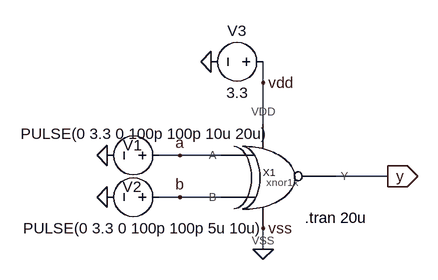
[diagram p0: schematic xnor1x_tb_tran.asc]
xnor1x_tb_tran.asc, the LTspice schematic file:
Version 4.1
SHEET 1 880 680
WIRE 160 16 160 -16
WIRE 160 80 160 16
WIRE 32 128 0 128
WIRE 96 128 32 128
WIRE 352 160 272 160
WIRE 32 192 0 192
WIRE 96 192 32 192
WIRE 160 272 160 240
FLAG 160 272 0
FLAG 352 160 y
IOPIN 352 160 Out
FLAG -80 128 0
FLAG -80 192 0
FLAG 80 -16 0
FLAG 32 128 a
FLAG 32 192 b
FLAG 160 16 vdd
FLAG 160 240 vss
SYMBOL voltage 16 128 R90
WINDOW 0 0 57 VBottom 2
WINDOW 3 -49 37 VTop 2
WINDOW 123 0 0 Left 0
WINDOW 39 0 0 Left 0
SYMATTR InstName V1
SYMATTR Value PULSE(0 3.3 0 100p 100p 10u 20u)
SYMBOL voltage 16 192 R90
WINDOW 0 0 58 VBottom 2
WINDOW 3 32 40 VTop 2
WINDOW 123 0 0 Left 0
WINDOW 39 0 0 Left 0
SYMATTR InstName V2
SYMATTR Value PULSE(0 3.3 0 100p 100p 5u 10u)
SYMBOL voltage 176 -16 R90
WINDOW 0 -32 56 VBottom 2
WINDOW 3 32 56 VTop 2
WINDOW 123 0 0 Left 0
WINDOW 39 0 0 Left 0
SYMATTR InstName V3
SYMATTR Value 3.3
SYMBOL diglib\\xnor1x\\xnor1x 176 160 R0
SYMATTR InstName X1
TEXT 224 224 Left 2 !.tran 20u

The netlist it stands for:
* xnor1x_tb_tran.asc
V1 a 0 PULSE(0 3.3 0 100p 100p 10u 20u)
V2 b 0 PULSE(0 3.3 0 100p 100p 5u 10u)
V3 vdd 0 3.3
X§X1 y a b vdd 0 xnor1x  ; pins Y A B VDD VSS
.tran 20u
.backanno
.end